# Altium schematic sheet 12V_Converter.SchDoc
size A
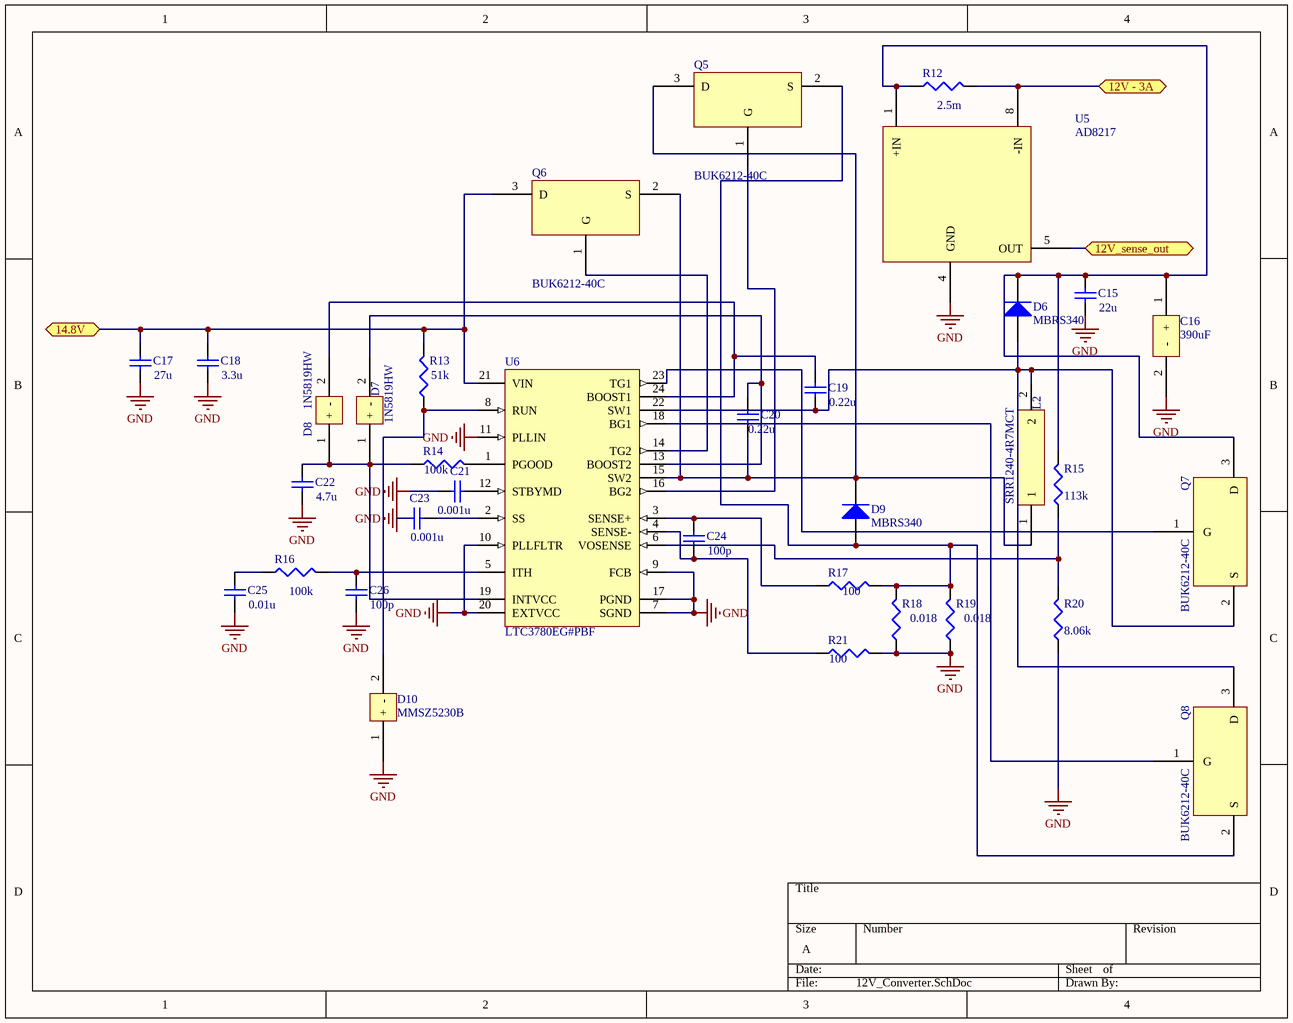
[diagram p0: 12V_Converter.SchDoc]

## Parts
C15  value 22u  [C1206]  (hidden comment: Cap Semi)
C16  390uF  [PCV1E391MCL2GS]
C17  value 27u  [C1206]  (hidden comment: Cap Semi)
C18  value 3.3u  [C1206]  (hidden comment: Cap Semi)
C19  value 0.22u  [C1206]  (hidden comment: Cap Semi)
C20  value 0.22u  [C1206]  (hidden comment: Cap Semi)
C21  value 0.001u  [C1206]  (hidden comment: Cap Semi)
C22  value 4.7u  [C1206]  (hidden comment: Cap Semi)
C23  value 0.001u  [C1206]  (hidden comment: Cap Semi)
C24  value 100p  [C1206]  (hidden comment: Cap Semi)
C25  value 0.01u  [C1206]  (hidden comment: Cap Semi)
C26  value 100p  [C1206]  (hidden comment: Cap Semi)
D6  MBRS340  [SMC]
D7  1N5819HW  [1N5819HW]
D8  1N5819HW  [1N5819HW]
D9  MBRS340  [SMC]
D10  MMSZ5230B  [MMSZ5230B]
L2  SRR1240-4R7MCT  [SRR1240-4R7M]
Q5  BUK6212-40C  [BUK6212-40C]
Q6  BUK6212-40C  [BUK6212-40C]
Q7  BUK6212-40C  [BUK6212-40C]
Q8  BUK6212-40C  [BUK6212-40C]
R12  value 2.5m  [J1-0603]  (hidden comment: Res3)
R13  value 51k  [J1-0603]  (hidden comment: Res3)
R14  value 100k  [J1-0603]  (hidden comment: Res3)
R15  value 113k  [J1-0603]  (hidden comment: Res3)
R16  value 100k  [J1-0603]  (hidden comment: Res3)
R17  value 100  [J1-0603]  (hidden comment: Res3)
R18  value 0.018  [J1-0603]  (hidden comment: Res3)
R19  value 0.018  [J1-0603]  (hidden comment: Res3)
R20  value 8.06k  [J1-0603]  (hidden comment: Res3)
R21  value 100  [J1-0603]  (hidden comment: Res3)
U5  AD8217  [AD8217]
U6  LTC3780EG#PBF  [LTC3780 24-Leaqd Plastic SSOP]

## Ports
12V - 3A, 12V_sense_out, 14.8V

## Nets
GND: C15.1 C16.2(-) C17.1 C18.1 C21.1 C22.1 C23.1 C25.1 C26.1 D10.1(+) R18.1 R19.1 R20.1 R21.2 U5.4(GND) U6.7(SGND) U6.9(FCB) U6.10(PLLFLTR) U6.11(PLLIN) U6.17(PGND) U6.20(EXTVCC)
12V - 3A: R12.2 U5.8(-IN) ; port 12V - 3A
12V_sense_out: U5.5(OUT) ; port 12V_sense_out
14.8V: C17.2 C18.2 Q6.3(D) R13.2 U6.21(VIN) ; port 14.8V
NetC15_2: C15.2 C16.1(+) D6.2(K) Q7.3(D) R12.1 R15.2 U5.1(+IN)
NetC19_1: C19.1 D6.1(A) L2.2 Q7.2(S) Q8.3(D) U6.22(SW1)
NetC19_2: C19.2 D8.2(-) U6.24(BOOST1)
NetC20_1: C20.1 D9.2(K) L2.1 Q5.3(D) Q6.2(S) U6.15(SW2)
NetC20_2: C20.2 D7.2(-) U6.13(BOOST2)
NetC21_2: C21.2 U6.12(STBYMD)
NetC22_2: C22.2 D7.1(+) D8.1(+) R14.1 U6.19(INTVCC)
NetC23_2: C23.2 U6.2(SS)
NetC24_1: C24.1 R21.1 U6.4(SENSE-)
NetC24_2: C24.2 R17.1 U6.3(SENSE+)
NetC25_2: C25.2 R16.1
NetC26_2: C26.2 R16.2 U6.5(ITH)
NetD9_1: D9.1(A) Q5.2(S) Q8.2(S) R17.2 R18.2 R19.2
NetD10_2: D10.2(-) R13.1 U6.8(RUN)
NetQ5_1: Q5.1(G) U6.16(BG2)
NetQ6_1: Q6.1(G) U6.14(TG2)
NetQ7_1: Q7.1(G) U6.23(TG1)
NetQ8_1: Q8.1(G) U6.18(BG1)
NetR14_2: R14.2 U6.1(PGOOD)
NetR15_1: R15.1 R20.2 U6.6(VOSENSE)

## Library data of the parts
C15 C17-C26 = Cap Semi: Capacitor (Semiconductor SIM Model); Published: 8-Jun-2000; LatestRevisionDate: 29-May-2009; LatestRevisionNote: IPC-7351 Footprint Added.; PackageReference: C1206; Publisher: Altium Limited; PackageDescription: Chip Capacitor
C16 = PCV1E391MCL2GS: Aluminum Capacitor
D6 D9 = Diode: Default Diode; Published: 8-Jun-2000; LatestRevisionDate: 17-Jul-2002; LatestRevisionNote: Re-released for DXP Platform.; PackageVersion: Sep-1996; PackageReference: SMC; Publisher: Altium Limited; PackageDescription: DO-214-AB/SMC; 2 C-Bend Leads; Body 7.9 x 5.9 mm, inc. leads (LxW); Code_JEDEC: DO-214-AB
D7 D8 = 1N5819HW: 1A Schottky Barrier Rectifier
D10 = MMSZ5230B: Zener Diode
L2 = SRR1240-4R7MCT: Inductor
Q5-Q8 = BUK6212-40C: N-Channel TrenchMOS Intermediate Level FET
R12-R21 = Res3: Resistor; Published: 8-Jun-2000; LatestRevisionDate: 29-May-2009; LatestRevisionNote: IPC-7351 Footprint Added.; PackageReference: J1-0603; Publisher: Altium Limited; PackageDescription: Chip Resistor
U5 = AD8217: Current Shunt Moniter
U6 = LTC3780EG#PBF: Buck-boost Controller, Constant Frequency, Current Mode Control with Power Good Output, 24-pin SOP (G-24), -40 to 85 degC, Pb-Free; Manufacturer: Linear Technology; Frequency Sync Range: 200kHz - 400kHz; Number of Outputs: 1; PackageDesciption: 24-Pin Plastic SSOP, Body 8.2 x 5.3 mm, Pitch 0.65 mm; ComponentLink1Description: Manufacturer URL; ComponentLink1URL: http://www.linear.com/; ComponentLink2Description: Datasheet; ComponentLink2URL: http://cds.linear.com/docs/en/datasheet/3780ff.pdf; ComponentLink3Description: Package Specification; ComponentLink3URL: http://cds.linear.com/docs/en/packaging/SSOP_24_05-08-1640.pdf; DatasheetVersion: Rev. F; Mounting Technology: Surface Mount; PackageReference: G-24; PackageVersion: Jun-10; PartNumber: LTC3780EG#PBF; RoHS: TRUE; Supplier 1: Digi-Key; Supplier 2: Farnell; Supplier 3: Newark; Supplier Part Number 1: LTC3780EG#PBF-ND; Supplier Part Number 2: 1273545; Supplier Part Number 3: 56M8395